# EAGLE schematic Jetson_PCB_SCH (EAGLE 9.5.0)
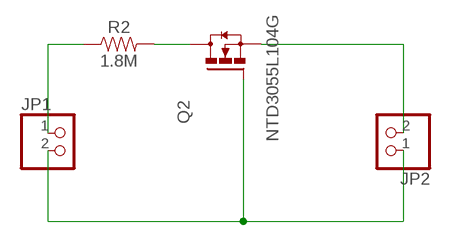
[diagram p0: schematic, sheet 1]

## Parts
JP1  PINHD-1X2  [1X02]
JP2  PINHD-1X2  [1X02]
Q2  NTD3055L104G  [DPAK4]
R2  1.8M  1.8MOHM  [0603]

## Nets
N$1: JP1.2 JP2.1 Q2.1(G)
N$2: JP1.1 R2.1
N$3: Q2.2(D) Q2.4(D) R2.2
N$4: JP2.2 Q2.3(S)

## Library data of the parts
JP1 JP2 = pinhead:PINHD-1X2: PIN HEADER
Q2 = Transistor:NTD3055L104G: 12 A, 60 V, Logic Level N−Channel DPAK/IPAK Manufacturer's datasheet <https://www.onsemi.com/pub/Collateral/NTD3055L104-D.PDF>; CREATED_BY: PCBLayout.com; MANUFACTURER: ON SEMICONDUCTORS; MPN: NTD3055L104G; PACKAGE: DPAK-4
R2 = SparkFun-Resistors:1.8MOHM: 1.8 MOhms ±5% 0.1W, 1/10W Chip Resistor 0603; PROD_ID: RES-13994